# EAGLE schematic eurocard (EAGLE 7.7.0)
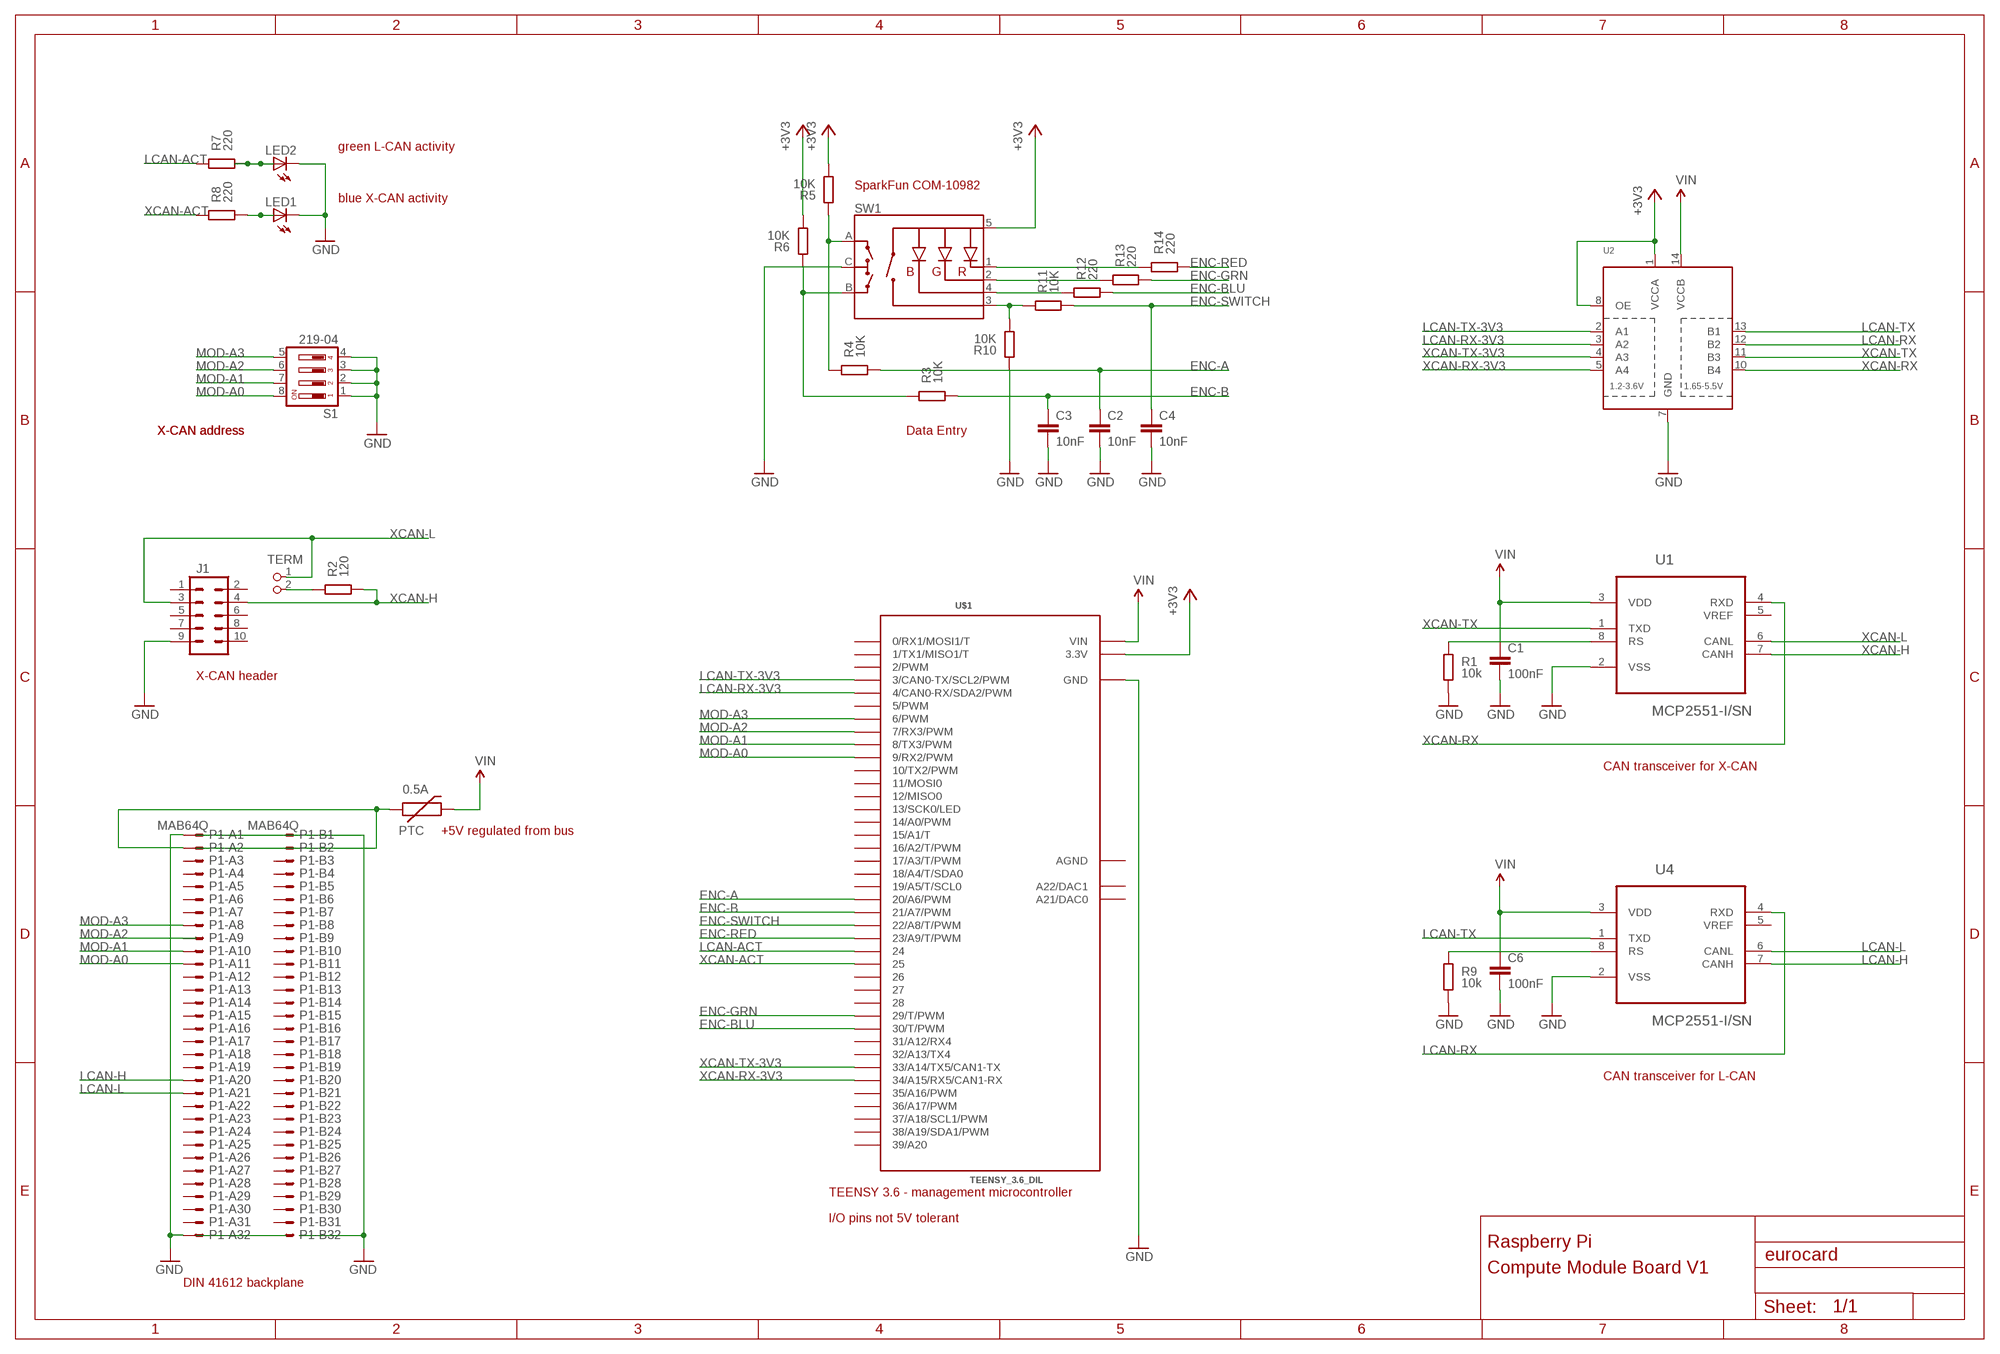
[diagram p0: schematic, sheet 1]

## Parts
0.5A  PTC  [MC331XX]
C1  100nF  C-EUC0805K  [C0805K]
C2  10nF  C-EUC0805K  [C0805K]
C3  10nF  C-EUC0805K  [C0805K]
C4  10nF  C-EUC0805K  [C0805K]
C6  100nF  C-EUC0805K  [C0805K]
J1  M05X2NO_SILK  [2X5_NOSILK]
LED1  LED1206  [LED-1206]
LED2  LED1206  [LED-1206]
P1  MAB64Q  [MAB64Q]
R1  10k  R-EU_M0805  [M0805]
R2  120  R-EU_M0805  [M0805]
R3  10K  R-EU_M0805  [M0805]
R4  10K  R-EU_M0805  [M0805]
R5  10K  R-EU_M0805  [M0805]
R6  10K  R-EU_M0805  [M0805]
R7  220  R-EU_M0805  [M0805]
R8  220  R-EU_M0805  [M0805]
R9  10k  R-EU_M0805  [M0805]
R10  10K  R-EU_M0805  [M0805]
R11  10K  R-EU_M0805  [M0805]
R12  220  R-EU_M0805  [M0805]
R13  220  R-EU_M0805  [M0805]
R14  220  R-EU_M0805  [M0805]
S1  219-04  [CTS-219-04]
SW1  ENCODER_RGB_CA  [ENCODER_LED_3]
TERM  PIN2_100  [PIN_W_2]
U1  MCP2551-I/SN  [SOIC127P600X175-8N]
U2  TXB0104PWR  [TSSOP14]
U4  MCP2551-I/SN  [SOIC127P600X175-8N]
U$1  TEENSY_3.6_DIL  [TEENSY_3.6_DIL]

## Nets
+3V3: R5.1 R6.1 SW1.5(+) U2.1(VCCA) U2.8(OE) U$1.3.3V U$1.3.3V3(3.3V)
+5VBUS: 0.5A.P$1 P1.A2
ENC-A: C2.1 R4.1 U$1.20/A6(20/A6/PWM)
ENC-B: C3.1 R3.1 U$1.21/A7(21/A7/PWM)
ENC-BLU: R12.1 U$1.30(30/T/PWM)
ENC-GRN: R13.1 U$1.29(29/T/PWM)
ENC-RED: R14.1 U$1.23/A9(23/A9/T/PWM)
ENC-SWITCH: C4.1 R11.1 U$1.22/A8(22/A8/T/PWM)
GND: C1.2 C2.2 C3.2 C4.2 C6.2 J1.9 LED1.C LED2.C P1.A1 P1.A32 R1.1 R9.1 S1.1 S1.2 S1.3 S1.4 SW1.C U2.7(GND) U$1.GND U$1.GND1(GND)
GND1: R2.2 TERM.2
LCAN-ACT: R7.2 U$1.24
LCAN-H: P1.A20 U4.7(CANH)
LCAN-L: P1.A21 U4.6(CANL)
LCAN-RX: U2.12(B2) U4.4(RXD)
LCAN-RX-3V3: U2.3(A2) U$1.4(4/CAN0-RX/SDA2/PWM)
LCAN-TX: U2.13(B1) U4.1(TXD)
LCAN-TX-3V3: U2.2(A1) U$1.3(3/CAN0-TX/SCL2/PWM)
MOD-A0: P1.A11 S1.8 U$1.9(9/RX2/PWM)
MOD-A1: P1.A10 S1.7 U$1.8(8/TX3/PWM)
MOD-A2: S1.6 U$1.7(7/RX3/PWM)
MOD-A3: P1.A8 S1.5 U$1.6(6/PWM)
N$1: R1.2 U1.8(RS)
N$2: R4.2 R5.2 SW1.A
N$3: R3.2 R6.2 SW1.B
N$4: U1.2(VSS) U4.2(VSS) ; supply symbol labelled GND
N$5: R10.1 R11.2 SW1.3(SW)
N$6: R12.2 SW1.4(-B)
N$7: R13.2 SW1.2(-G)
N$8: R10.2 ; supply symbol labelled GND
N$9: R14.2 SW1.1(-R)
N$10: LED2.A R7.1
N$11: LED1.A R8.1
N$16: R9.2 U4.8(RS)
VIN: 0.5A.P$2 C1.1 C6.1 U1.3(VDD) U2.14(VCCB) U4.3(VDD) U$1.VIN
XCAN-ACT: R8.2 U$1.25
XCAN-H: J1.4 R2.1 U1.7(CANH)
XCAN-L: J1.3 TERM.1 U1.6(CANL)
XCAN-RX: U1.4(RXD) U2.10(B4)
XCAN-RX-3V3: U2.5(A4) U$1.34/A15(34/A15/RX5/CAN1-RX)
XCAN-TX: U1.1(TXD) U2.11(B3)
XCAN-TX-3V3: U2.4(A3) U$1.33/A14(33/A14/TX5/CAN1-TX)
Unconnected: J1.1 J1.2 J1.5 J1.6 J1.7 J1.8 J1.10 P1.A3 P1.A4 P1.A5 P1.A6 P1.A7 P1.A9 P1.A12 P1.A13 P1.A14 P1.A15 P1.A16 P1.A17 P1.A18 P1.A19 P1.A22 P1.A23 P1.A24 P1.A25 P1.A26 P1.A27 P1.A28 P1.A29 P1.A30 P1.A31 P1.B1 P1.B2 P1.B3 P1.B4 P1.B5 P1.B6 P1.B7 P1.B8 P1.B9 P1.B10 P1.B11 P1.B12 P1.B13 P1.B14 P1.B15 P1.B16 P1.B17 P1.B18 P1.B19 P1.B20 P1.B21 P1.B22 P1.B23 P1.B24 P1.B25 P1.B26 P1.B27 P1.B28 P1.B29 P1.B30 P1.B31 P1.B32 U1.5(VREF) U4.5(VREF) U$1.0(0/RX1/MOSI1/T) U$1.1(1/TX1/MISO1/T) U$1.2(2/PWM) U$1.5(5/PWM) U$1.10(10/TX2/PWM) U$1.11(11/MOSI0) U$1.12(12/MISO0) U$1.13(13/SCK0/LED) U$1.14/A0(14/A0/PWM) U$1.15/A1(15/A1/T) U$1.16/A2(16/A2/T/PWM) U$1.17/A3(17/A3/T/PWM) U$1.18/A4(18/A4/T/SDA0) U$1.19/A5(19/A5/T/SCL0) U$1.26 U$1.27 U$1.28 U$1.31/A12(31/A12/RX4) U$1.32/A13(32/A13/TX4) U$1.35/A16(35/A16/PWM) U$1.36/A17(36/A17/PWM) U$1.37/A18(37/A18/SCL1/PWM) U$1.38/A19(38/A19/SDA1/PWM) U$1.39/A20 U$1.A21(A21/DAC0) U$1.A22(A22/DAC1)

## Notes on the sheet
- green L-CAN activity
- SparkFun COM-10982
- blue X-CAN activity
- X-CAN address | X-CAN address | Data Entry
- X-CAN header
- CAN transceiver for X-CAN
- +5V regulated from bus
- CAN transceiver for L-CAN
- TEENSY 3.6 - management microcontroller
- I/O pins not 5V tolerant
- Raspberry Pi
- Compute Module Board V1
- DIN 41612 backplane

## Power pins joined to a net without a drawn wire
AGND: U$1.AGND

## Library data of the parts
0.5A = GeekAmmo:PTC: PTC Resettable Fuse
C1-C4 C6 = resistor:C-EU: CAPACITOR, European symbol; DIELECTRIC: X7R
J1 = SparkFun-Connectors:M05X2: Header 5x2 Standard 10-pin dual row 0.1" header. Commonly used with AVR-ISP. Use with Spark Fun Electronics SKU: PRT-00778
LED1 LED2 = LilyPad-Wearables:LED: LEDs Standard schematic elements and footprints for 5mm, 3mm, 1206, and 0603 sized LEDs. 5mm - Spark Fun Electronics SKU : Comp-SBL
P1 = con-vg:MAB64Q: CONNECTOR male, 64 pins, type Q, rows AB, grid 2.54 mm
R1-R14 = resistor:R-EU_: RESISTOR, European symbol; TOLERANCE: 5%
S1 = switch-dil:219-04*: Surface Mount DIP Switch Series 219 SMT CTS Electronic Components Sourc: www.ctscorp.com; OC_FARNELL: unknown; OC_NEWARK: unknown
SW1 = SparkFun-Electromechanical:ENCODER_RGB_CA: Illuminated Rotary Encoder w/ RGB LED and select switch EC12PLRGBSDVBF-D: http://top-up.so-buy.com/front/bin/ptdetail.phtml?Part=EC12PLRGBSDVBF-D
TERM = FLYFISH:PIN2
U1 U4 = Microchip_By_element14_Batch_1:MCP2551-I/SN: High-Speed CAN Transceiver; MPN: MCP2551-I/SN; OC_FARNELL: 9758569; OC_NEWARK: 69K7604; PACKAGE: SOIC-8; SUPPLIER: Microchip
U2 = adafruit:TXB0104PWR: 4-Bit Bi-Directional Level Shifter 1.2V-3.6V (VCCA) to 1.65V-5.5V (VCCB) bi-directional level shifter with auto direction sensing. Max data rate - VCCA 1.8V: 20Mbps (50ns), VCCA 3.3V: 100Mbps (10ns) Digikey: 296-21929-1-ND
U$1 = Teensy_3_and_LC_Series_Boards_v1.4:TEENSY_3.6_DIL: Teensy 3.6 DIL Package